# EAGLE design Spinner (EAGLE 7.3.0)
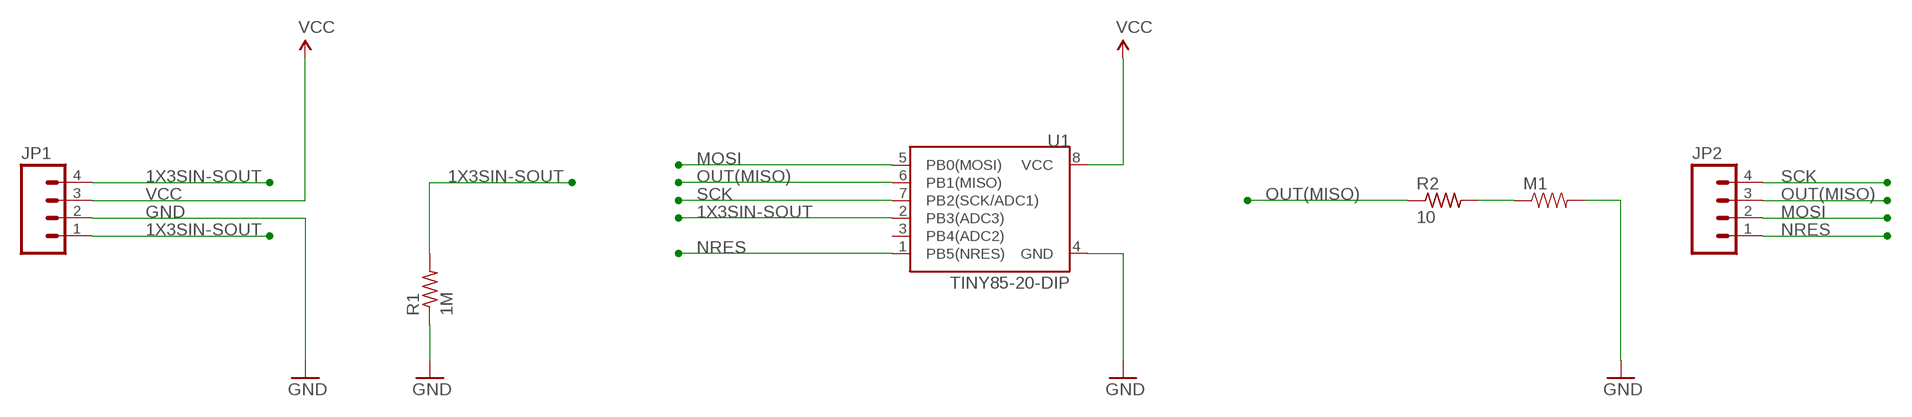
[diagram p0: schematic, sheet 1]

## Parts
JP1  M04PTH  [1X04]
JP2  M04PTH  [1X04]
M1  10OHM-1/4W-5%(PTH)VERT-KIT  [AXIAL-0.1EZ]
R1  1M  R-US_R0603  [R0603]
R2  10  R-US_R0603  [R0603]
U1  TINY85-20-DIP  ATTINY45TINY85-20-DIP  [DIP08]

## Nets
1X3SIN-SOUT: JP1.1 JP1.4 R1.2 U1.2(PB3(ADC3))
GND: JP1.2 M1.P$2 R1.1 U1.4(GND)
MOSI: JP2.2 U1.5(PB0(MOSI))
N$1: M1.P$1 R2.2
NRES: JP2.1 U1.1(PB5(NRES))
OUT(MISO): JP2.3 R2.1 U1.6(PB1(MISO))
SCK: JP2.4 U1.7(PB2(SCK/ADC1))
VCC: JP1.3 U1.8(VCC)
Unconnected: U1.3(PB4(ADC2))

## Library data of the parts
JP1 JP2 = SparkFun-Connectors:M04: Header 4 Standard 4-pin 0.1" header. Use with straight break away headers (SKU : PRT-00116), right angle break away headers (PRT-00553), swiss pins (PRT-00743), machine pins (PRT-00117), and female headers (PRT-00115). Molex polarized connector foot print use with SKU : PRT-08231 with associated crimp pins and housings. 1MM SMD Version SKU: PRT-10208
M1 = SparkFun-Resistors:10OHM-1/4W-5%(PTH): RES-10698; PROD_ID: RES-10698; VALUE: 10
R1 R2 = adafruit:R-US_: RESISTOR, American symbol
U1 = SparkFun-DigitalIC:ATTINY45: Atmel 8-pin 2/4/8kB flash uC; PROD_ID: IC-09445

## Board
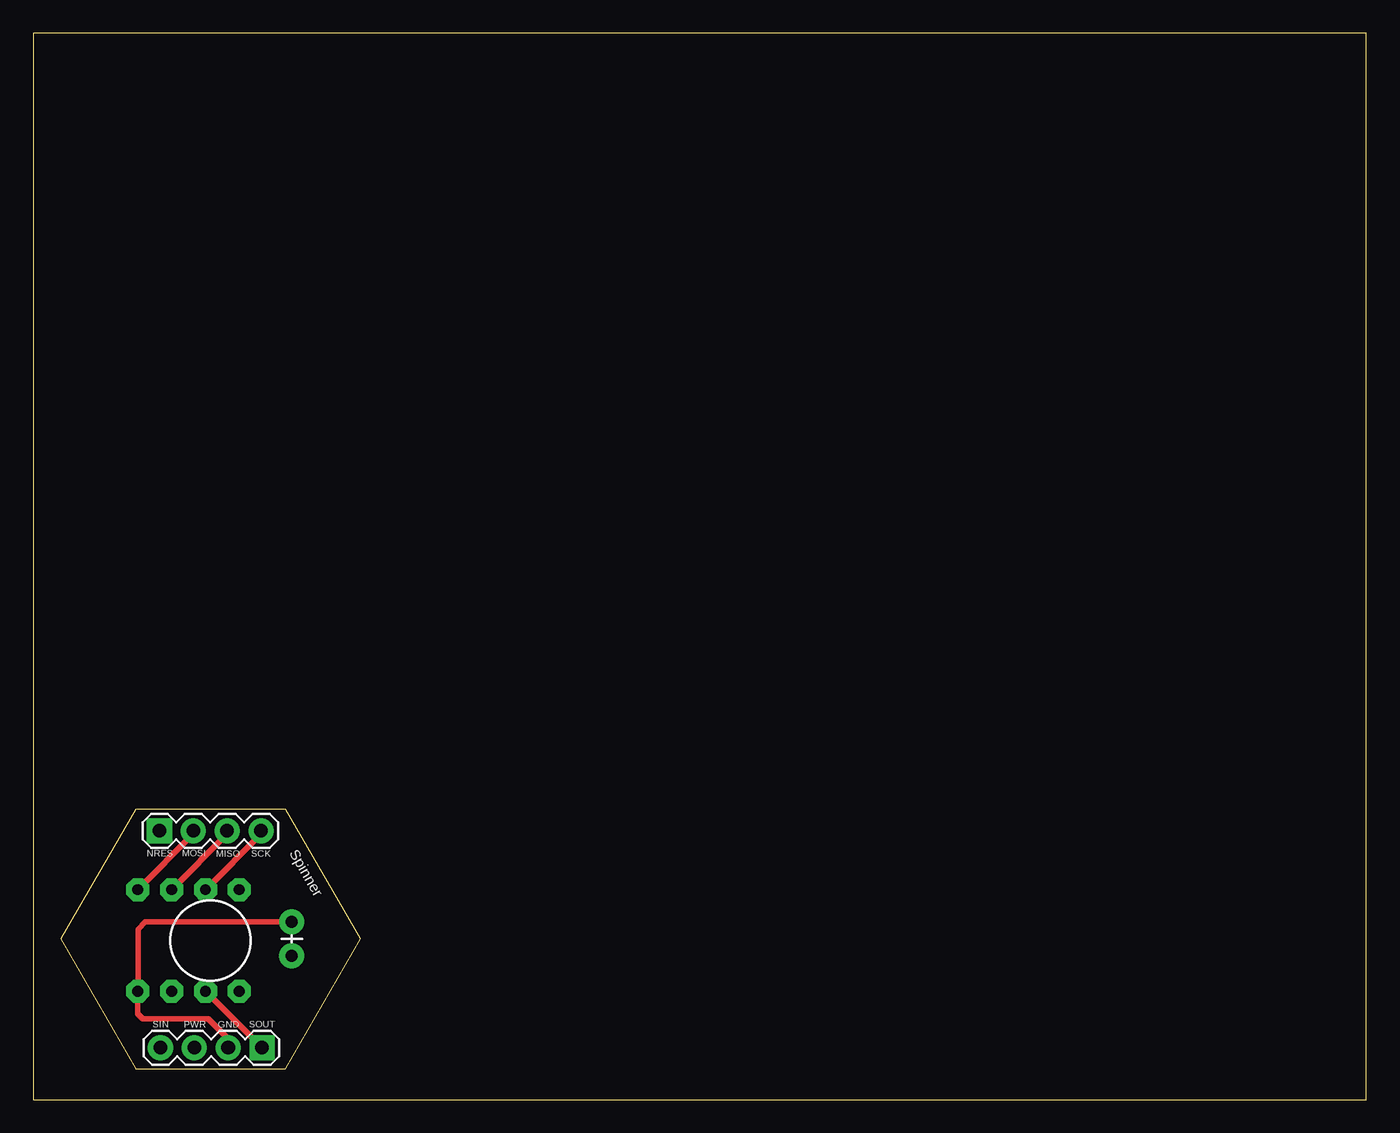
[diagram p1: board, top side]
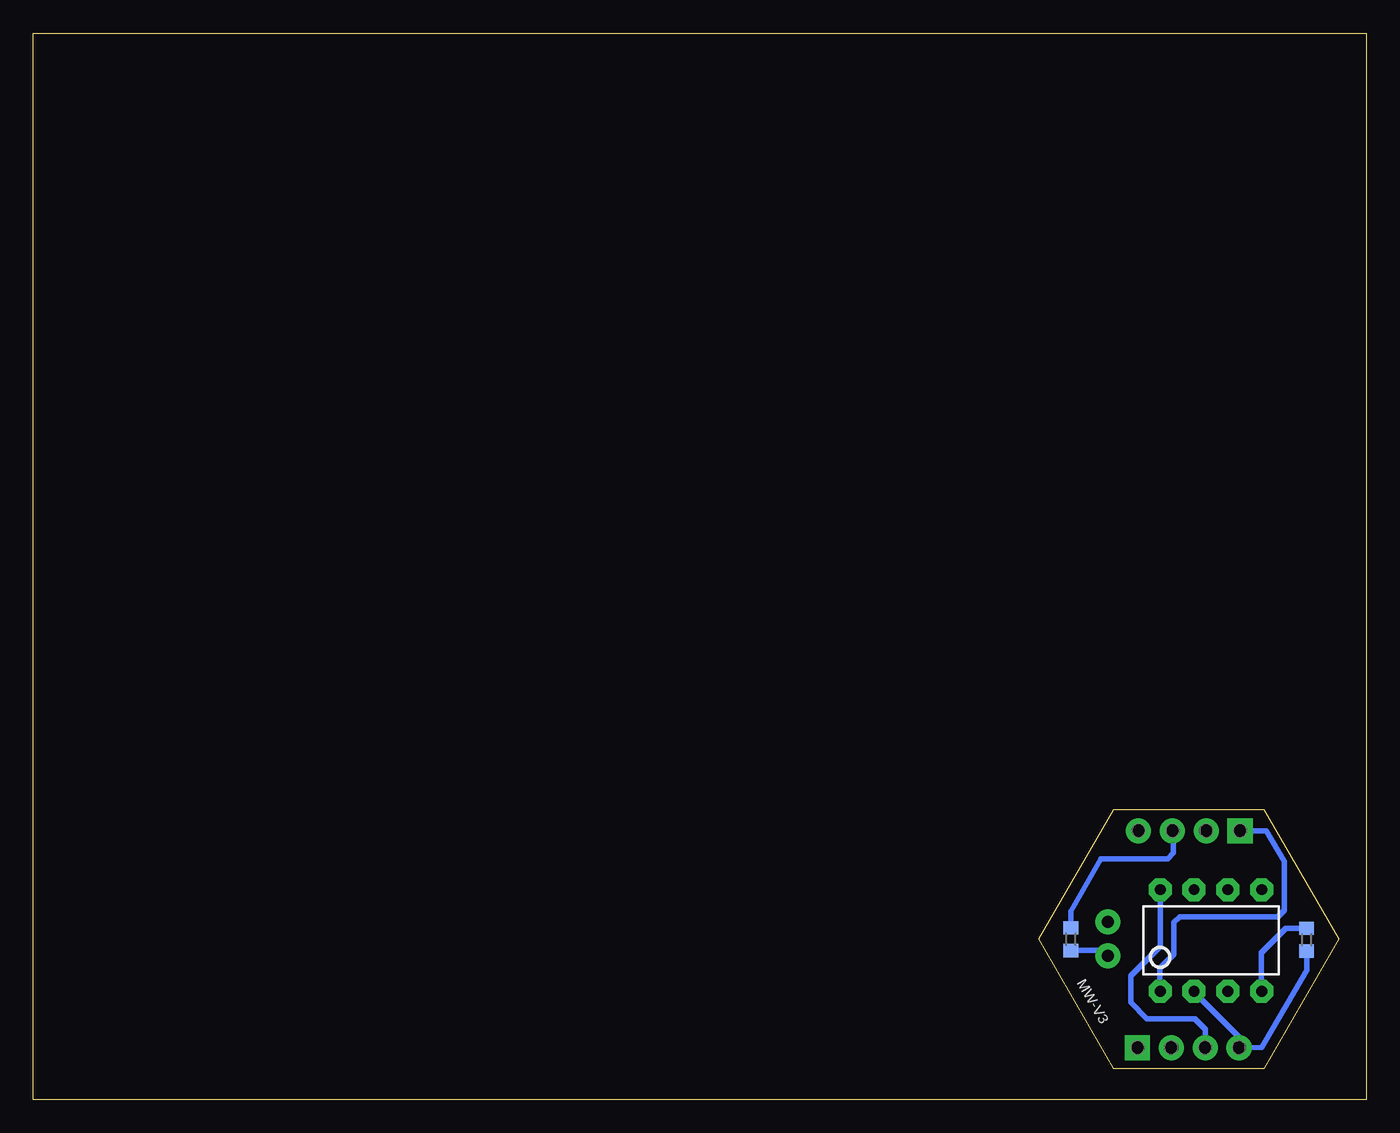
[diagram p2: board, bottom side, seen from below]

Size 100 x 80 mm. Coordinates in mm from the lower left corner, seen from the top.
Outline: 0,0 100,0 100,80 0,80 0,0
Outline: 7.69,2.3 18.94,2.3 24.56,12.04 18.94,21.78 7.69,21.78 2.06,12.04 7.69,2.3
Copper layers (1*16): Top 0.035mm / dielectric 1.5mm / Bottom 0.035mm
Design rules "default *": minimum track width 10mil, minimum drill 24mil, track to track 8mil, track to pad 8mil, pad to pad 8mil, via to via 8mil, smd to smd 8mil, copper to edge 0mil, drill to drill 8mil, minimum pad ring 10mil, minimum via ring 8mil, stop-mask expansion 4mil, vias tented up to drill 0mil, thermal gap 10mil

### Footprints (pad centres in the part's own frame; a part is rotated, then mirrored left to right if it is on the bottom)
1X04 = drill 1.016 pad 1.88 square: 1 0,0 | drill 1.016 pad 1.88: 2 2.54,0; 3 5.08,0; 4 7.62,0
AXIAL-0.1EZ = drill 0.9 pad 1.88: P$1 0,0; P$2 2.54,0
R0603 = smd 1 x 1.1: 1 -0.85,0; 2 0.85,0
DIP08 = drill 0.813 pad 1.727 octagon: 1 -3.81,-3.81; 2 -1.27,-3.81; 3 1.27,-3.81; 4 3.81,-3.81; 5 3.81,3.81; 6 1.27,3.81; 7 -1.27,3.81; 8 -3.81,3.81

### Placement (x,y rotation side)
JP1  17.16,3.89 180 top
JP2  9.46,20.17 0 top
M1  19.39,10.78 90 top
R1  4.47,11.99 270 bottom
R2  22.16,12.03 270 bottom
U1  11.65,11.94 0 bottom

### Tracks (layer width: path | path; a pad name or v marks a point on that pad's centre or on a via)
1X3SIN-SOUT
  Top 0.4: U1.2 JP1.1
  Bottom 0.4: U1.2 12.92,8.08 9.54,4.7 JP1.4 7.85,3.91 4.46,9.7 4.47,9.72 R1.2
GND
  Top 0.4: M1.P$2 8.41,13.32 7.86,12.78 7.86,8.15 U1.4 7.82,8.12 7.82,6.43 8.19,6.06 13.11,6.06 14.62,4.55 JP1.2
  Bottom 0.4: R1.1 6.03,12.84 7.86,11.01 7.86,8.15 U1.4
MOSI
  Top 0.4: JP2.2 12,19.91 U1.5
N$1
  Bottom 0.4: R2.2 19.79,11.18 M1.P$1
NRES
  Bottom 0.4: JP2.1 7.51,20.17 6.15,17.88 6.15,14.19 6.62,13.72 13.99,13.72 14.43,13.28 14.43,10.9 15.48,9.84 15.48,8.15 U1.1
OUT(MISO)
  Top 0.4: JP2.3 14.54,19.91 U1.6
  Bottom 0.4: R2.1 22.16,14.11 22.17,14.12 19.9,18.07 14.9,18.07 14.48,18.49 14.48,20.1 JP2.3
SCK
  Top 0.4: JP2.4 17.08,19.91 U1.7
VCC
  Bottom 0.4: U1.8 15.46,11.49 17.65,9.3 17.65,7.28 16.45,6.07 12.87,6.07 12.08,5.28 12.06,5.28 12.06,3.9 JP1.3

### Text on the board
tPlace: NRES | MOSI | MISO | SCK | Spinner | SIN | PWR | GND | SOUT
bPlace: MW-V3